# EAGLE design Dummy_load_2_(4-30V_0-4.25A)_v1.2 (EAGLE 9.6.2)
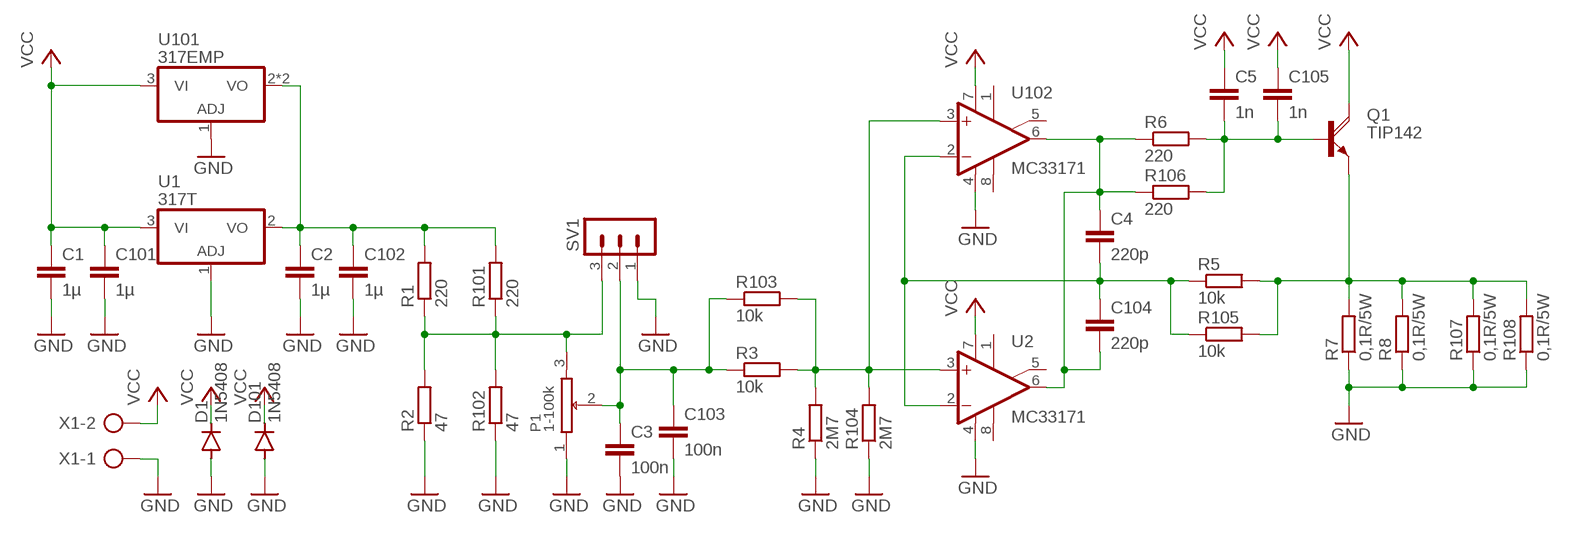
[diagram p0: schematic, sheet 1]

## Parts
C1  1µ  C-EU050-024X044  [C050-024X044]
C2  1µ  C-EU050-024X044  [C050-024X044]
C3  100n  C-EU050-024X044  [C050-024X044]
C4  220p  C-EU050-024X044  [C050-024X044]
C5  1n  C-EU050-024X044  [C050-024X044]
C101  1µ  C-EUC1206  [C1206]
C102  1µ  C-EUC1206  [C1206]
C103  100n  C-EUC1206  [C1206]
C104  220p  C-EUC1206  [C1206]
C105  1n  C-EUC1206  [C1206]
D1  1N5408  DIODE-C1702-06  [C1702-06]
D101  1N5408  DIODE-DO214AA  [DO214AA]
P1  1-100k  POT1_POTH_1  [POT1_POTH_1]
Q1  TIP142  TIP142VERTICAL  [SOT93V]
R1  220  R-EU_0207/10  [0207/10]
R2  47  R-EU_0207/10  [0207/10]
R3  10k  R-EU_0207/10  [0207/10]
R4  2M7  R-EU_0207/10  [0207/10]
R5  10k  R-EU_0207/10  [0207/10]
R6  220  R-EU_0207/10  [0207/10]
R7  0,1R/5W  R-EU_VTA53  [VTA53]
R8  0,1R/5W  R-EU_VTA53  [VTA53]
R101  220  R-EU_R1206  [R1206]
R102  47  R-EU_R1206  [R1206]
R103  10k  R-EU_R1206  [R1206]
R104  2M7  R-EU_R1206  [R1206]
R105  10k  R-EU_R1206  [R1206]
R106  220  R-EU_R1206  [R1206]
R107  0,1R/5W  R-EU_0817/7V  [P0817V]
R108  0,1R/5W  R-EU_0817/7V  [P0817V]
SV1  MA03-1  [MA03-1]
U1  317T  [TO220H]
U2  MC33171  LM741P  [DIL08]
U101  317EMP  [SOT223]
U102  MC33171  LM741D  [SO08]
X1  AK500/2  [AK500/2]

## Nets
GND: C1.2 C2.2 C3.2 C101.2 C102.2 C103.2 D1.A D101.A P1.1 R2.1 R4.1 R7.1 R8.1 R102.1 R104.1 R107.1 R108.1 SV1.1 U1.1(ADJ) U2.4(V-) U101.1(ADJ) U102.4(V-) X1.1
N$1: C2.1 C102.1 R1.2 R101.2 U1.2(VO) U101.2(VO) U101.4(VO)
N$2: P1.3 R1.1 R2.2 R101.1 R102.2 SV1.3
N$3: C3.1 C103.1 P1.2 R3.1 R103.1 SV1.2
N$4: R3.2 R4.2 R103.2 R104.2 U2.3(+IN) U102.3(+IN)
N$5: Q1.E R5.2 R7.2 R8.2 R105.2 R107.2 R108.2
N$7: C4.2 C104.1 R5.1 R105.1 U2.2(-IN) U102.2(-IN)
N$8: C4.1 C104.2 R6.1 R106.1 U2.6(OUT) U102.6(OUT)
N$9: C5.2 C105.2 Q1.B R6.2 R106.2
VCC: C1.1 C5.1 C101.1 C105.1 D1.C D101.C Q1.C U1.3(VI) U2.7(V+) U101.3(VI) U102.7(V+) X1.2
Unconnected: U2.1(ON1) U2.5(ON2) U2.8(OPT) U102.1(ON1) U102.5(ON2) U102.8(OPT)

## Library data of the parts
C1-C5 C101-C105 = rcl-custom:C-EU: CAPACITOR, European symbol; SPICEPREFIX: C
D1 D101 = diode-custom:DIODE-: DIODE
P1 = pot1:POT1_POTH_1
Q1 = transistor-power-custom:TIP142: NPN DARLINGTON TRANSISTOR
R1-R8 R101-R108 = rcl-custom:R-EU_: RESISTOR, European symbol; SPICEPREFIX: R
SV1 = con-lstb:MA03-1: PIN HEADER; OC_FARNELL: unknown; OC_NEWARK: unknown
U1 U101 = linear-custom:*317: Positive VOLTAGE REGULATOR
U2 U102 = linear-custom:*741: OP AMP
X1 = con-ptr500-custom:AK500/2: CONNECTOR; OC_FARNELL: unknown; OC_NEWARK: unknown

## Board
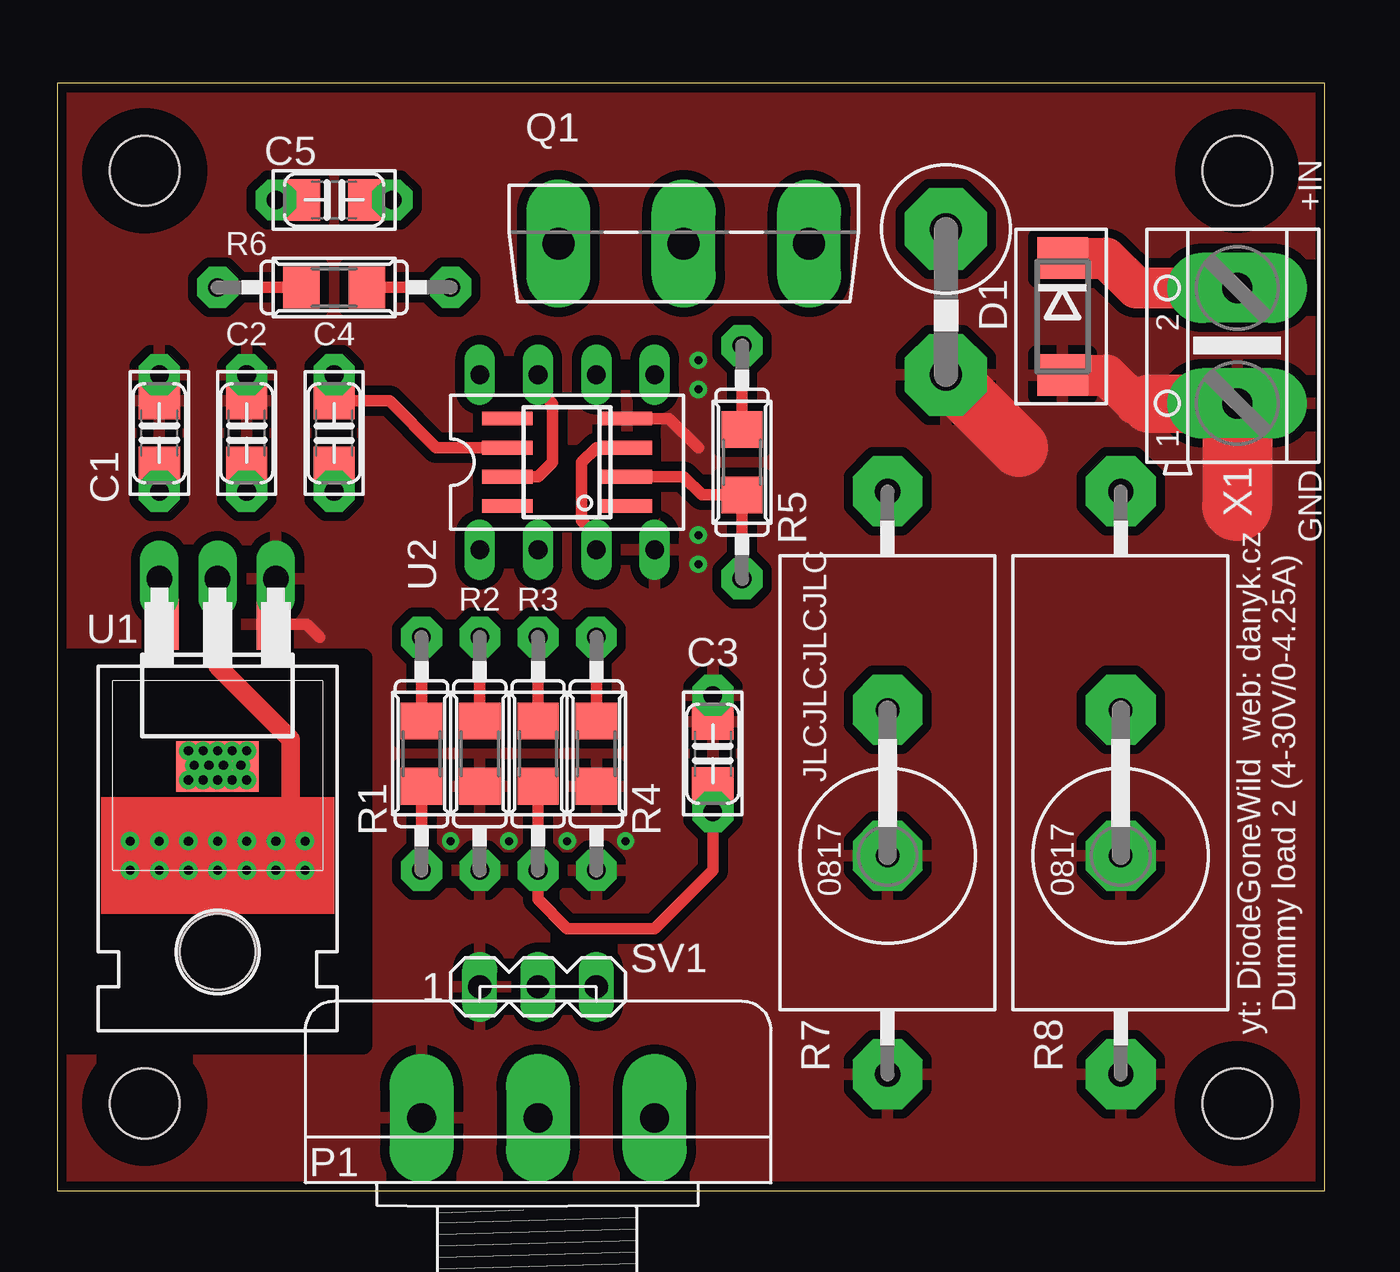
[diagram p1: board, top side]
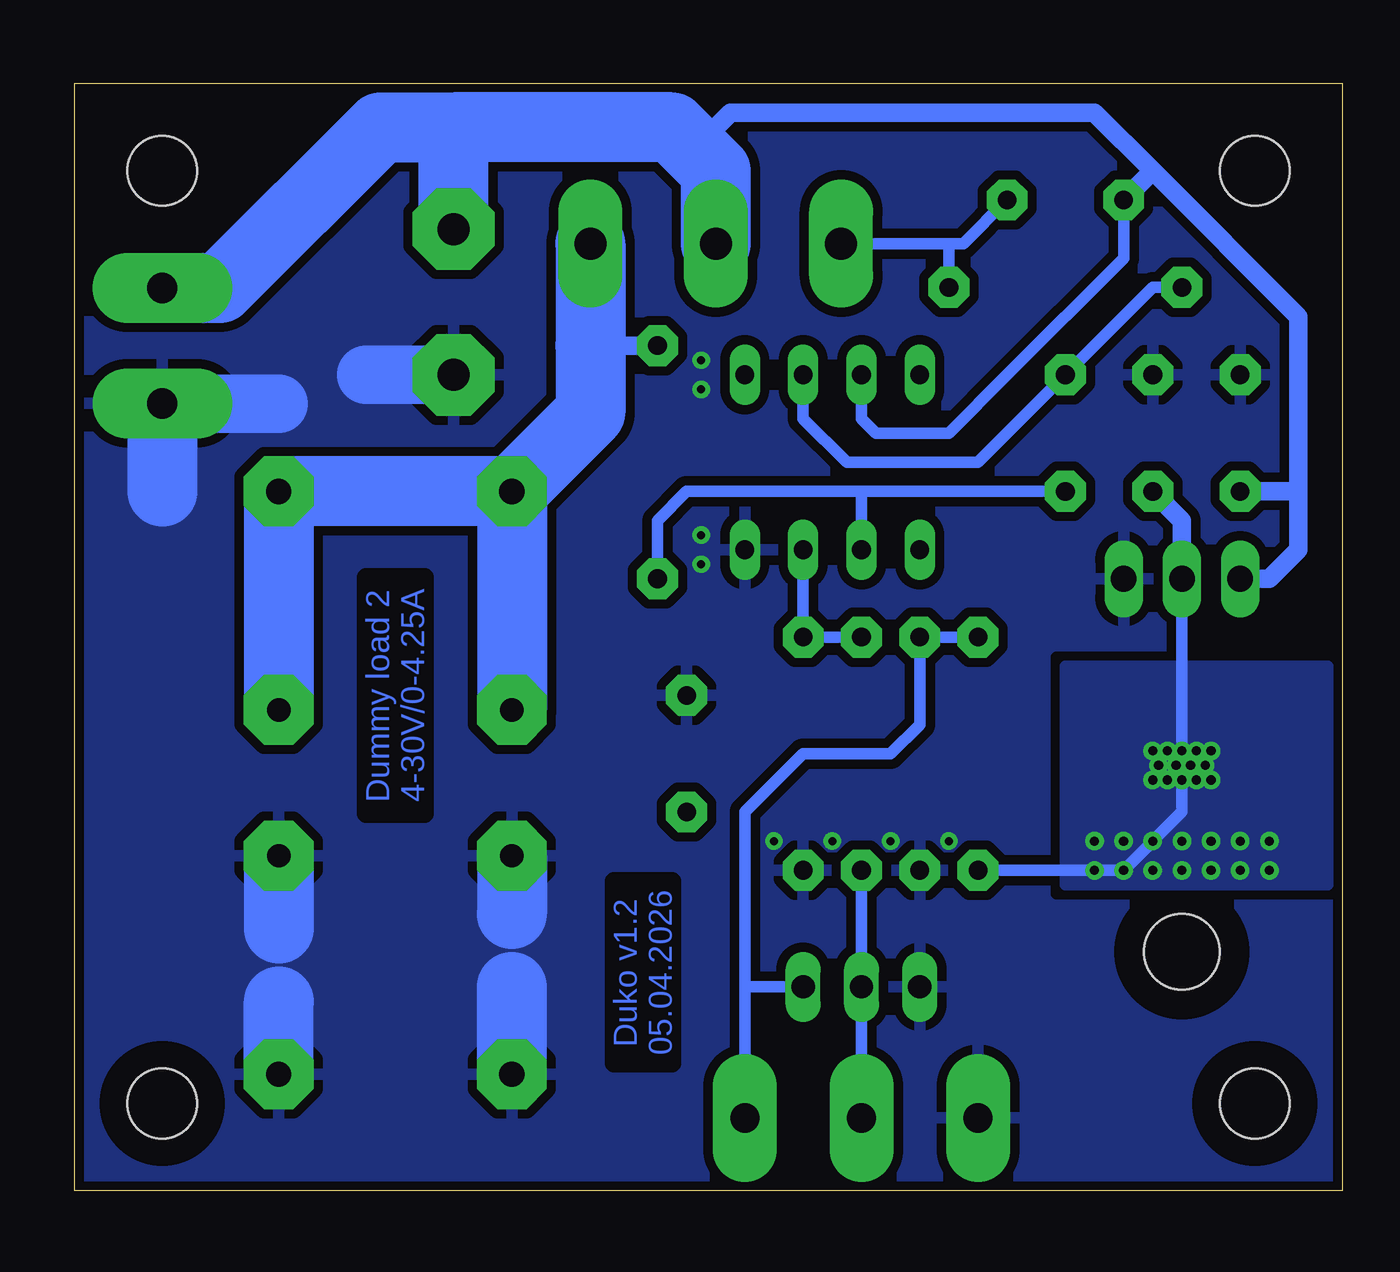
[diagram p2: board, bottom side, seen from below]

Size 55.24 x 48.26 mm. Coordinates in mm from the lower left corner, seen from the top.
Outline: 0,0 55.24,0 55.24,48.26 0,48.26 0,0
Copper layers (1*16): Top 0.035mm / dielectric 1.5mm / Bottom 0.035mm
Design rules "default *": minimum track width 6mil, minimum drill 0.35mm, track to track 6mil, track to pad 6mil, pad to pad 6mil, via to via 6mil, smd to smd 6mil, copper to edge 15mil, drill to drill 6mil, minimum pad ring 10mil, minimum via ring 8mil, stop-mask expansion 4mil, vias tented up to drill 14mil, thermal gap 16mil
Holes 3.05 mm at 3.81,3.81 51.44,3.81 3.81,44.45 51.44,44.45
tRestrict: area 0.6,6.4 to 13.3,23.2; area 2.1,2.1 to 5.5,5.5; area 49.8,2.1 to 53.1,5.5; area 49.8,42.8 to 53.1,46.1; area 2.1,42.8 to 5.5,46.1
bRestrict: area 2.1,2.1 to 5.5,5.5; area 49.8,2.1 to 53.1,5.5

### Footprints (pad centres in the part's own frame; a part is rotated, then mirrored left to right if it is on the bottom)
C050-024X044 = drill 0.813 pad 1.778 octagon: 1 -2.54,0; 2 2.54,0
C1206 = smd 1.6 x 1.8: 1 -1.4,0; 2 1.4,0
C1702-06 = drill 1.397 pad 3.556 octagon: A 3.81,0; C -2.54,0
DO214AA = smd 1.8 x 2.2: A 2.55,0; C -2.55,0
POT1_POTH_1 = drill 1.27 pad 2.794 long: 1 5.08,3.81; 2 0,3.81; 3 -5.08,3.81
SOT93V = drill 1.397 pad 2.794 long: B -5.461,-2.54; C 0,-2.54; E 5.461,-2.54
0207/10 = drill 0.813 pad 1.778 octagon: 1 -5.08,0; 2 5.08,0
VTA53 = drill 1.1 pad 3.048 octagon: 1 -12.7,0; 2 12.7,0
R1206 = smd 1.6 x 1.803: 1 -1.422,0; 2 1.422,0
P0817V = drill 1.016 pad 3.048 octagon: 1 -5.08,0; 2 1.27,0
MA03-1 = drill 1.016 long: 1 -2.54,0; 2 0,0; 3 2.54,0
TO220H = drill 1.118 long: 1 -2.54,-11.43; 2 0,-11.43; 3 2.54,-11.43 | hole 3.302: 0,4.826
DIL08 = drill 0.813 pad 1.27 long: 1 -3.81,-3.81; 2 -1.27,-3.81; 3 1.27,-3.81; 4 3.81,-3.81; 5 3.81,3.81; 6 1.27,3.81; 7 -1.27,3.81; 8 -3.81,3.81
SOT223 = smd 1.219 x 2.235: 1 -2.311,-3.099; 2 0,-3.099; 3 2.311,-3.099 | smd 3.6 x 2.2: 4 0,3.099
SO08 = smd 0.6 x 2.2: 1 -1.905,-2.6; 2 -0.635,-2.6; 3 0.635,-2.6; 4 1.905,-2.6; 5 1.905,2.6; 6 0.635,2.6; 7 -0.635,2.6; 8 -1.905,2.6
AK500/2 = drill 1.321 pad 3.048 long: 1 -2.515,0; 2 2.515,0

### Placement (x,y rotation side)
C1  4.45,33.02 90 top
C2  8.26,33.02 90 top
C3  28.57,19.05 90 top
C4  12.06,33.02 270 top
C5  12.06,43.18 0 top
C101  4.45,33.02 90 top
C102  8.26,33.02 90 top
C103  28.57,19.05 90 top
C104  12.06,33.02 90 top
C105  12.06,43.18 0 top
D1  38.73,39.37 270 top
D101  43.81,38.1 270 top
P1  20.95,6.99 180 top
Q1  27.3,43.81 0 top
R1  15.88,19.05 270 top
R2  18.41,19.05 90 top
R3  20.95,19.05 90 top
R4  23.5,19.05 90 top
R5  29.84,31.75 90 top
R6  12.06,39.37 0 top
R7  36.2,17.78 90 top
R8  46.35,17.78 90 top
R101  15.88,19.05 270 top
R102  18.41,19.05 90 top
R103  20.95,19.05 90 top
R104  23.5,19.05 90 top
R105  29.84,31.75 90 top
R106  12.06,39.37 0 top
R107  36.2,19.68 90 top
R108  46.35,19.68 90 top
SV1  20.95,8.89 0 top
U1  6.99,15.24 180 top
U2  22.23,31.75 0 top
U101  6.99,21.59 180 top
U102  22.23,31.75 90 top
X1  51.44,36.83 90 top

### Tracks (layer width: path | path; a pad name or v marks a point on that pad's centre or on a via)
GND  (via drill 0.35)
  Top 0.508: U1.1 9.53,24.92 U101.1 10.87,24.69 11.43,24.13 | U102.4 26.67,33.66 27.94,32.38
  Top 1.778: X1.1 51.41,34.29 | D101.A 45.73,35.55 46.99,34.29
  Top 2.54: 51.41,34.29 47.62,34.29 | D1.A 41.91,32.38
  Top 3.048: X1.1 51.44,29.84
  Bottom 1.778: X1.1 51.41,34.29
  Bottom 2.54: 51.41,34.29 46.35,34.29 | D1.A 42.55,35.56
  Bottom 3.048: X1.1 51.44,30.48 | R8.1 46.35,8.26 | R7.1 36.2,8.89 | R107.1 36.2,12.06 | R108.1 46.35,11.43
  other vias: 17.14,15.24 19.68,15.24 22.23,15.24 24.77,15.24 27.94,27.3 27.94,28.57 27.94,34.92 27.94,36.2
  pour Bottom (isolate 0.406, rank 2): -2.54,50.8 -2.54,-2.54 57.78,-2.54 57.78,50.8
  pour Top (isolate 0.406, rank 2): -5.71,53.34 -5.71,-5.71 60.96,-5.71 60.96,53.34
N$1  (via drill 0.4)
  Top 0.508: R1.2 R101.2 | C102.1 C2.1 | U101.4 v6.99,19.18
  Top 0.813: U1.2 U101.2 6.99,22.86 10.16,19.68 10.16,15.88 v9.53,15.24
  Bottom 0.508: R1.2 v9.53,13.97 6.99,16.51 v6.99,17.91 v6.99,19.18 U1.2 7.24,26.42
  Bottom 0.813: C2.1 6.99,29.21 U1.2
  other vias: 5.71,19.18 8.26,19.18 8.26,17.91 5.71,17.91 6.35,19.18 5.97,18.54 6.35,17.91 6.6,18.54 7.62,19.18 7.24,18.54 7.62,17.91 8,18.54 3.17,15.24 4.45,15.24 5.71,15.24 6.99,15.24 8.26,15.24 10.79,15.24 3.17,13.97 4.45,13.97 5.71,13.97 6.99,13.97 8.26,13.97 10.79,13.97
  pour Bottom: 0.64,22.86 12.06,22.86 12.06,13.34 0.64,13.34
N$2
  Top 0.508: R2.2 R102.2 | R1.1 R101.1
  Bottom 0.508: R1.1 R2.2 18.41,20.32 19.68,19.05 23.5,19.05 26.04,16.51 26.04,8.89 | SV1.3 26.04,8.89 | P1.3 26.04,8.89
N$3
  Top 0.508: R103.1 R3.1 20.95,12.7 22.23,11.43 26.04,11.43 28.57,13.97 C3.1 C103.1
  Bottom 0.508: R3.1 SV1.2 P1.2
N$4
  Top 0.508: R3.2 R103.2 | R4.2 R104.2 | U102.3 23.5,32.38 22.86,31.75 22.86,29.21 23.5,28.57 U2.3
  Bottom 0.508: R3.2 R4.2 U2.3
N$5
  Top 0.508: R5.2 R105.2
  Bottom 0.813: R5.2 32.77,36.83
  Bottom 3.048: R7.2 R8.2 R108.2 | Q1.E 32.77,36.83 32.77,33.91 R7.2 | R7.2 R107.2
N$7
  Top 0.508: R5.1 R105.1 28.09,30.33 27.3,31.11 U102.2 | C4.2 C104.1
  Bottom 0.508: C4.2 20.95,30.48 | 20.95,30.48 28.57,30.48 29.84,29.21 R5.1 | U2.2 20.95,30.48
N$8
  Top 0.508: R6.1 R106.1 | C4.1 C104.2 14.47,34.42 16.51,32.38 U102.6
  Bottom 0.508: R6.1 8.26,39.37 C4.1 15.88,31.75 21.59,31.75 23.5,33.66 U2.6
N$9
  Top 0.508: R106.2 R6.2
  Top 0.813: C5.2 C105.2
  Bottom 0.508: C5.2 16.51,41.27 17.14,41.27 | 17.14,41.27 Q1.B | R6.2 17.14,41.27
VCC
  Top 0.508: U2.7 20.95,34.92 21.59,34.29 21.59,31.75 20.95,31.11 U102.7 | U1.3 4.67,26.44 U101.3 | C1.1 C101.1
  Top 0.813: C105.1 C5.1
  Top 1.778: D101.C 45.71,40.65 47.02,39.34 X1.2
  Bottom 0.508: U2.7 20.95,33.66 20.32,33.02 17.14,33.02 14.61,35.56 9.53,40.64 C5.1
  Bottom 0.813: 1.91,30.48 1.91,38.1 8.26,44.45 | 1.91,30.48 1.91,27.94 3.17,26.67 U1.3 | 1.91,30.48 C1.1 | 8.26,44.45 10.79,46.99 26.66,46.99 27.3,46.34 Q1.C | C5.1 8.26,44.45
  Bottom 3.048: 38.73,46.34 29.21,46.34 27.3,44.44 Q1.C | 38.73,46.34 41.92,46.34 48.92,39.34 X1.2 | D1.C 38.73,46.34
(copper drawn outside any net)
  shapes: Top area x1

### Text on the board
Bottom: Dummy load 2 / 4-30V/0-4.25A | Duko v1.2 / 05.04.2026
tNames: +IN | GND | JLCJLCJLCJLC | yt: DiodeGoneWild web: danyk.cz / Dummy load 2 (4-30V/0-4.25A)